# Altium schematic sheet L_BAND_V1_0.schdoc
size 240 x 206 mm
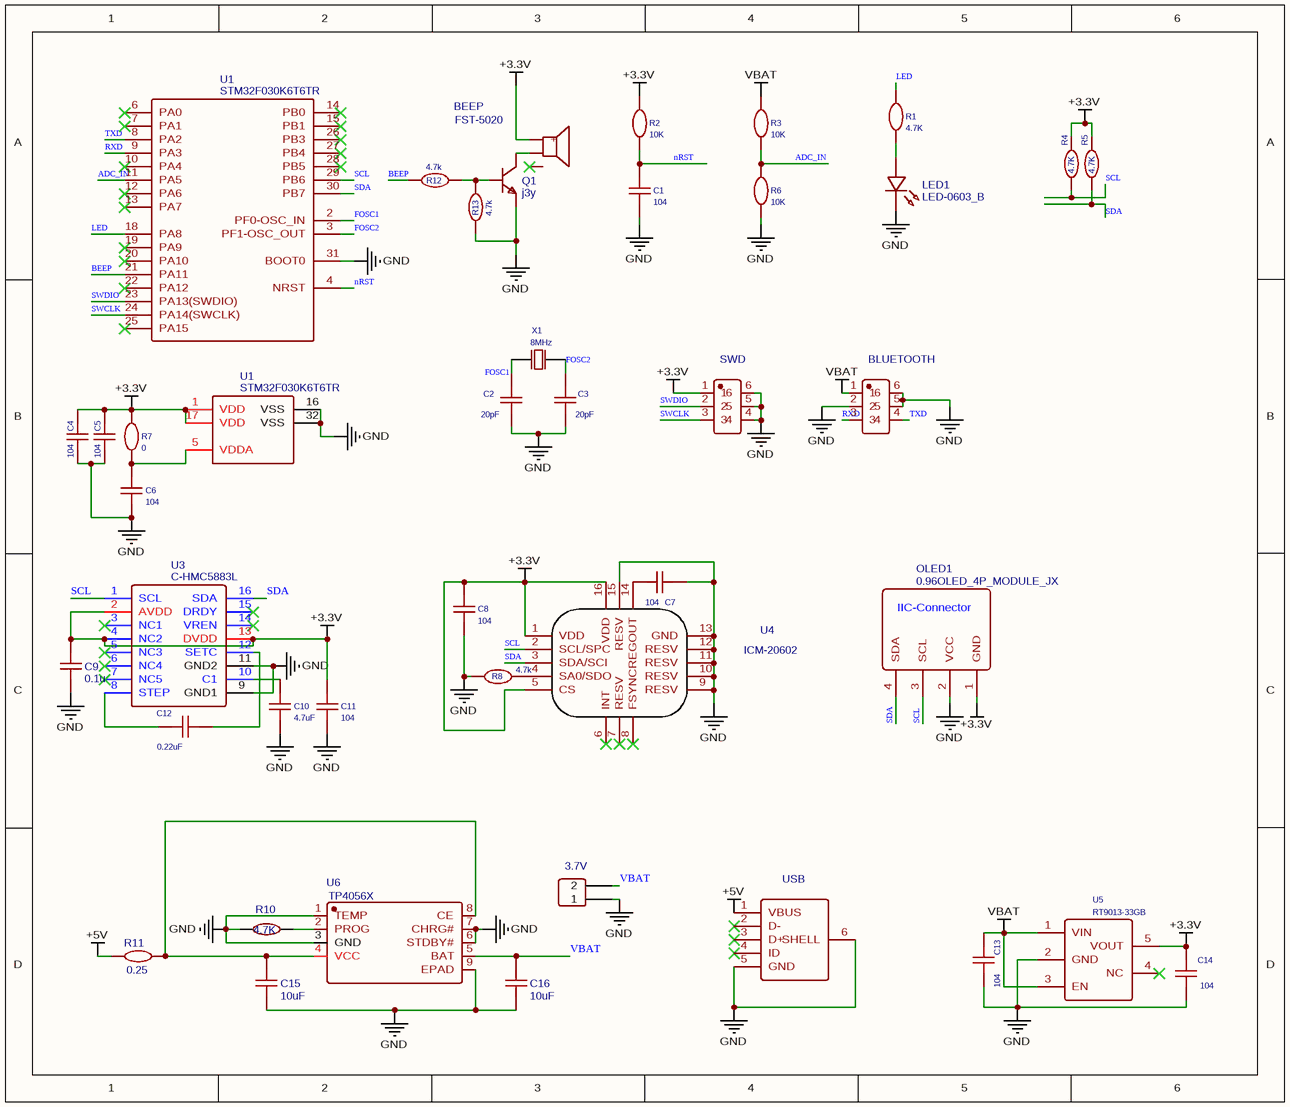
[diagram p0: L_BAND_V1_0.schdoc]

## Parts
(Parts that share a designator on the sheet are numbered #1, #2 ... from top to bottom, then left to right.)
3.7V  3.7V 400mAH  [HDR-TH_2P-P2.54-V-M]  (value not drawn)
BEEP  FST-5020  [BUZ-SMD_FST-5020]
BLUETOOTH  BLUETOOTH  [CONN-SMD_SH1.0X4]  (value not drawn)
C1  104  [C0603]
C2  20pF  [C0603]
C3  20pF  [C0603]
C4  104  [C0603]
C5  104  [C0603]
C6  104  [C0603]
C7  104  [C0603]
C8  104  [C0603]
C9  0.1u  [C0603]
C10  4.7uF  [C0603]
C11  104  [C0603]
C12  0.22uF  [C0603]
C13  104  [C0603]
C14  104  [C0603]
C15  10uF  [C0805]
C16  10uF  [C0805]
LED1  LED-0603_B  [LED0603_BLUE]
OLED1  0.96OLED_4P_MODULE_JX  [0.96OLED_4P]
Q1  j3y  [J3Y]
R1  4.7K  [R0603]
R2  10K  [R0603]
R3  10K  [R0603]
R4  4.7K  [R0603]
R5  4.7K  [R0603]
R6  10K  [R0603]
R7  0  [R0603]
R8  4.7k  [R0603]
R10  4.7K  [R0603]
R11  0.25  [R1206]
R12  4.7k  [R0603]
R13  4.7k  [R0603]
SWD  SWD  [CONN-SMD_SH1.0X4]  (value not drawn)
U1#1  STM32F030K6T6TR  [LQFP-32_L7.0-W7.0-P0.80-LS9.0-TL]
U1#2  STM32F030K6T6TR  [LQFP-32_L7.0-W7.0-P0.80-LS9.0-TL]
U3  C-HMC5883L  [HMC]
U4  ICM-20602  [LGA-16_L3.0-W3.0-ICM20602]
U5  RT9013-33GB  [SOT-23-5_L3.0-W1.7-P0.95-LS2.8-BR]
U6  TP4056X  [SOP-8_L4.9-W3.9-P1.27-LS6.0-BL-EP]
USB  MICRO XNJ ZB  [MICRO-USB-SMD_MICRO-XNJ-ZB]  (value not drawn)
X1  8MHz  [SMD-5032_2P]

## Nets
+3.3V: BEEP.1(+) C4.2 C5.2 C8.1 C9.2 C11.2 C14.2 OLED1.1(GND) R2.2 R4.1 R5.1 R7.2 SWD.1 U1#2.1(VDD) U1#2.17(VDD) U3.2(AVDD) U3.4(NC2) U3.13(DVDD) U4.1(VDD) U4.5(CS) U4.16(VDD) U5.5(VOUT)
+5V: R11.1 USB.1(VBUS)
GND: 3.7V.1 BLUETOOTH.2 BLUETOOTH.5 BLUETOOTH.6 C1.1 C2.1 C3.1 C4.1 C5.1 C6.2 C7.2 C8.2 C9.1 C10.1 C11.1 C13.1 C14.1 C15.2 C16.2 LED1.2 OLED1.2(VCC) Q1.2(E) R6.1 R8.2 R10.1 R13.2 SWD.4 SWD.5 SWD.6 U1#1.31(BOOT0) U1#2.16(VSS) U1#2.32(VSS) U3.9(GND1) U3.11(GND2) U4.9(RESV) U4.10(RESV) U4.11(RESV) U4.12(RESV) U4.13(GND) U4.15(RESV) U5.2(GND) U6.1(TEMP) U6.3(GND) U6.6(STDBY#) U6.7(CHRG#) U6.9(EPAD) USB.5(GND) USB.6(SHELL)
VBAT: 3.7V.2 BLUETOOTH.1 C13.2 C16.1 R3.2 U5.1(VIN) U5.3(EN) U6.5(BAT)
ADC_IN: R3.1 R6.2 U1#1.11(PA5)
BEEP: R12.2 U1#1.21(PA11)
FOSC1: C2.2 U1#1.2(PF0-OSC_IN) X1.1(OSC1)
FOSC2: C3.2 U1#1.3(PF1-OSC_OUT) X1.2(OSC2)
LED: R1.2 U1#1.18(PA8)
nRST: C1.2 R2.1 U1#1.4(NRST)
RXD: BLUETOOTH.3 U1#1.9(PA3)
SCL: OLED1.3(SCL) R4.2 U1#1.29(PB6) U3.1(SCL) U4.2(SCL/SPC)
SDA: OLED1.4(SDA) R5.2 U1#1.30(PB7) U3.16(SDA) U4.3(SDA/SCI)
SWCLK: SWD.3 U1#1.24(PA14(SWCLK))
SWDIO: SWD.2 U1#1.23(PA13(SWDIO))
TXD: BLUETOOTH.4 U1#1.8(PA2)
NetBEEP_2: BEEP.2 Q1.3(C)
NetC6_1: C6.1 R7.1 U1#2.5(VDDA)
NetC7_1: C7.1 U4.14(REGOUT)
NetC10_2: C10.2 U3.10(C1)
NetC12_1: C12.1 U3.8(STEP)
NetC12_2: C12.2 U3.12(SETC)
NetC15_1: C15.1 R11.2 U6.4(VCC) U6.8(CE)
NetLED1_1: LED1.1 R1.1
NetQ1_1: Q1.1(B) R12.1 R13.1
NetR8_1: R8.1 U4.4(SA0/SDO)
NetR10_2: R10.2 U6.2(PROG)

Not connected (* = marked no-connect by the designer): BEEP 3*; U1#1 6(PA0)* 7(PA1)* 10(PA4)* 12(PA6)* 13(PA7)* 14(PB0)* 15(PB1)* 19(PA9)* 20(PA10)* 22(PA12)* 25(PA15)* 26(PB3)* 27(PB4)* 28(PB5)*; U3 3(NC1)* 5(NC3)* 6(NC4)* 7(NC5)* 14(VREN)* 15(DRDY)*; U4 6(INT)* 7(RESV)* 8(FSYNC)*; U5 4(NC)*; USB 2(D-)* 3(D+)* 4(ID)*

## Notes on the sheet
- (in symbol 0.96OLED_4P_MODULE_JX) IIC-Connector

## Library data of the parts
3.7V = 3.7V 400mAH: BOM_Manufacturer: ReliaPro; BOM_Manufacturer Part: 2.54mm 1*2P; BOM_Supplier: LCSC; image: http://image.lceda.cn/szlcsc/C36717.jpg; BOM_Supplier Part: C36717; spicePre: P; spiceSymbolName: 2.54mm 1*2P
BEEP = FST-5020: BOM_Manufacturer: FUET; Contributor: LCSC; Frequency: 4000Hz; BOM_Supplier: LCSC; BOM_Supplier Part: C391029; BOM_Manufacturer Part: FST-5020; BOM_JLCPCB Part Class: Extended Part; spicePre: B; spiceSymbolName: FST-5020
BLUETOOTH = BLUETOOTH: BOM_Manufacturer: null; BOM_Manufacturer Part: SH1.0X4卧贴; Contributor: LCSC; BOM_Supplier: LCSC; BOM_Supplier Part: C9900002342; BOM_JLCPCB Part Class: Extended Part; spicePre: U; spiceSymbolName: SH1.0X4卧贴
C1 C4-C8 C11 C13 C14 = 104: nameAlias: Value(F); Contributor: LCEDA_Lib; spicePre: C; spiceSymbolName: C_0805_US
C2 C3 = 20pF: nameAlias: Value(F); Contributor: LCEDA_Lib; spicePre: C; spiceSymbolName: C_0805_US
C9 = 0.1u: nameAlias: Value(F); Contributor: LCEDA_Lib; spicePre: C; spiceSymbolName: C_0603_US
C10 = 4.7uF: nameAlias: Value(F); Contributor: LCEDA_Lib; spicePre: C; spiceSymbolName: C_0805_US
C12 = 0.22uF: nameAlias: Value(F); Contributor: LCEDA_Lib; spicePre: C; spiceSymbolName: C_0805_US
C15 C16 = 10uF: BOM_Manufacturer: Samsung Electro-Mechanics; BOM_Manufacturer Part: CL21A106KQFNNNE; nameAlias: Capacitance; Contributor: LCSC; BOM_Supplier: LCSC; BOM_Supplier Part: C307525; spicePre: C; spiceSymbolName: CL21A106KQFNNNE
LED1 = LED-0603_B: BOM_Manufacturer: EVERLIGHT(台湾亿光); BOM_Manufacturer Part: 19-217/BHC-ZL1M2RY/3T; Contributor: LCEDA_01; BOM_Supplier Part: C72041; BOM_Supplier: LCSC; spicePre: L; spiceSymbolName: LED-0603_B
OLED1 = 0.96OLED_4P_MODULE_JX: BOM_Manufacturer: null; Contributor: LCSC; BOM_Supplier: LCSC; BOM_Supplier Part: C9900004566; BOM_Manufacturer Part: 0.96OLED_4P_MODULE_JX; spicePre: O; spiceSymbolName: 0.96OLED_4P_MODULE_JX
Q1 = j3y: BOM_Manufacturer: (MDD) Jiangsu Yutai Elec; BOM_Manufacturer Part: S8050-J3Y; Contributor: youshutian; BOM_Supplier: LCSC; BOM_Supplier Part: C364312; spicePre: Q; spiceSymbolName: j3y
R1 R4 R5 = 4.7K: nameAlias: Value(Ω); Contributor: LCEDA_Lib; spicePre: R; spiceSymbolName: R_0805_EU
R2 R3 R6 = 10K: nameAlias: Value(Ω); Contributor: LCEDA_Lib; spicePre: R; spiceSymbolName: R_0805_EU
R7 = 0: nameAlias: Value(Ω); Contributor: LCEDA_Lib; spicePre: R; spiceSymbolName: R_0805_EU
R8 R12 R13 = 4.7k: nameAlias: Value(Ω); Contributor: LCEDA_Lib; spicePre: R; spiceSymbolName: R_0805_EU
R10 = 4.7K: BOM_Manufacturer: UniOhm; BOM_Manufacturer Part: 0603WAF1201T5E; nameAlias: Resistance (Ohms); SMT Type: Basic; BOM_Supplier: LCSC; BOM_LCSC Assembly: Yes; BOM_Supplier Part: C22765; spicePre: R; spiceSymbolName: 0603WAF1201T5E
R11 = 0.25: BOM_Manufacturer: TA-I Tech; BOM_Manufacturer Part: RL12FTNR250; nameAlias: Resistance (Ohms); Contributor: LCSC; BOM_Supplier: LCSC; BOM_Supplier Part: C160921; spicePre: R; spiceSymbolName: RL12FTNR250
SWD = SWD: BOM_Manufacturer: null; BOM_Manufacturer Part: SH1.0X4卧贴; Contributor: LCSC; BOM_Supplier: LCSC; BOM_Supplier Part: C9900002342; BOM_JLCPCB Part Class: Extended Part; spicePre: U; spiceSymbolName: SH1.0X4卧贴
U1#1 U1#2 = STM32F030K6T6TR: BOM_Manufacturer: STMicroelectronics; subpart_no: 1; BOM_Supplier: LCSC; BOM_Supplier Part: C88446; BOM_Manufacturer Part: STM32F030K6T6TR; BOM_JLCPCB Part Class: Extended Part; spicePre: U; spiceSymbolName: STM32F030K6T6TR
U3 = C-HMC5883L: BOM_Manufacturer: Honeywell; Contributor: PQG2030PQG; BOM_Supplier: LCSC; BOM_Manufacturer Part: HMC5883L; BOM_Supplier Part: C15640; spicePre: U; spiceSymbolName: C-HMC5883L
U4 = ICM-20602: BOM_Manufacturer Part: ICM20602; Contributor: bee2363; BOM_Supplier Part: 410-ICM-20602; BOM_Supplier: Mouser; spicePre: U; spiceSymbolName: ICM-20602
U5 = RT9013-33GB: BOM_Manufacturer: RICHTEK; BOM_Paste Type: recommend; BOM_Supplier: LCSC; BOM_Manufacturer Part: RT9013-33GB; image: //image.lceda.cn/szlcsc/C47773.jpg; BOM_Supplier Part: C47773; spicePre: U; spiceSymbolName: RT9013-33GB
U6 = TP4056X: BOM_Manufacturer: Nanjing Extension Microelectronics; Contributor: LCSC; BOM_Supplier: LCSC; BOM_Supplier Part: C191323; BOM_Manufacturer Part: TP4056X; spicePre: U; spiceSymbolName: TP4056X
USB = MICRO XNJ ZB: BOM_Manufacturer: SHOU HAN(首韩); Contributor: LCSC; BOM_Supplier: LCSC; BOM_Supplier Part: C668587; BOM_Manufacturer Part: MICRO XNJ ZB; BOM_JLCPCB Part Class: Extended Part; spicePre: U; spiceSymbolName: MICRO XNJ ZB
X1 = 8MHz: BOM_Manufacturer: Abracon LLC; BOM_Manufacturer Part: ABM2-29.4912MHZ-D4Y-T; nameAlias: Frequency; Contributor: LCSC; BOM_Supplier: LCSC; BOM_Supplier Part: C313041; spicePre: X; spiceSymbolName: ABM2-29.4912MHZ-D4Y-T